# Altium schematic sheet VoltageDivider.SchDoc
size A4
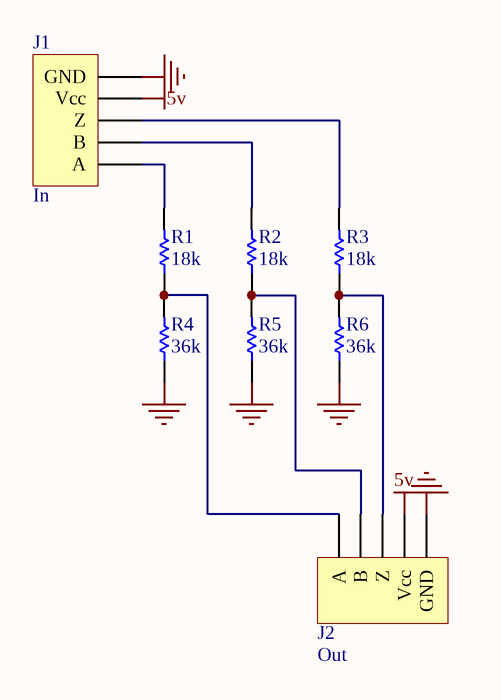
[diagram p0: VoltageDivider.SchDoc]

## Parts
J1  In  [HDR1X5]
J2  Out  [HDR1X5]
R1  value 18k  [Res SMD 0805A]  (hidden comment: Res1)
R2  value 18k  [Res SMD 0805A]  (hidden comment: Res1)
R3  value 18k  [Res SMD 0805A]  (hidden comment: Res1)
R4  value 36k  [Res SMD 0805A]  (hidden comment: Res1)
R5  value 36k  [Res SMD 0805A]  (hidden comment: Res1)
R6  value 36k  [Res SMD 0805A]  (hidden comment: Res1)

## Nets
5v: J1.4(Vcc) J2.4(Vcc)
GND: J1.5(GND) J2.5(GND) R4.1 R5.1 R6.1
NetJ1_1: J1.1(A) R1.2
NetJ1_2: J1.2(B) R2.2
NetJ1_3: J1.3(Z) R3.2
NetJ2_1: J2.1(A) R1.1 R4.2
NetJ2_2: J2.2(B) R2.1 R5.2
NetJ2_3: J2.3(Z) R3.1 R6.2

## Library data of the parts
J1 J2 = Header 5: Header, 5-Pin; LatestRevisionDate: 17-Jul-2002; LatestRevisionNote: Re-released for DXP Platform.; Publisher: Altium Limited
R1-R6 = Resistor